# Altium schematic sheet 01-SFP_module.SchDoc
size A
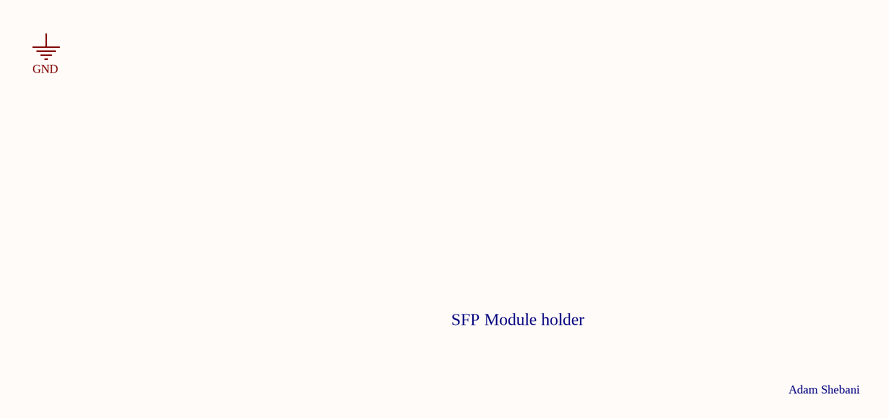
[diagram p0: 01-SFP_module.SchDoc]

## Notes on the sheet
- SFP Module holder
- Adam Shebani
- Labels drawn without touching a wire or pin: GND